# Altium schematic sheet 06_nRF52840_Analog.SchDoc
size 420 x 297 mm; Author: Shpakov Dmitry; Address1: Address1; Address2: Address2; Address3: Address3; Address4: Address4; DocumentNumber: АБВГ.123456.001 Э3; SheetNumber: 7; SheetTotal: 13; Scale: 1:1; DocumentType: Схема электрическая принципиальная; FirstReferrence: АБВГ.123456.001
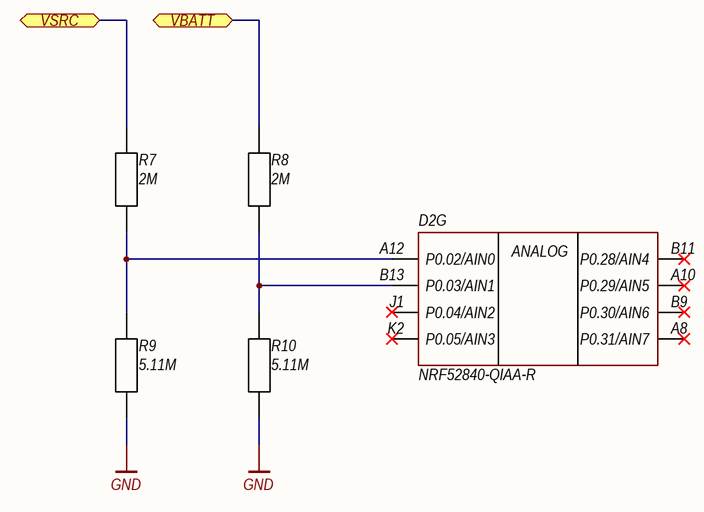
[diagram p0: 06_nRF52840_Analog.SchDoc]

## Parts
D2  NRF52840-QIAA-R  [AQFN50P700X700X85_HS-74N]  (part G of 9)
R7  2M  [RESC1608X05N]
R8  2M  [RESC1608X05N]
R9  5.11M  [RESC1608X05N]
R10  5.11M  [RESC1608X05N]

## Ports
VBATT, VSRC

## Nets
GND: R9.1 R10.1
VBATT: R8.2 ; port VBATT
VSRC: R7.2 ; port VSRC
NetD2_A12: D2.A12(P0.02/AIN0) R7.1 R9.2
NetD2_B13: D2.B13(P0.03/AIN1) R8.1 R10.2

Not connected (* = marked no-connect by the designer): D2 A8(P0.31/AIN7)* A10(P0.29/AIN5)* B9(P0.30/AIN6)* B11(P0.28/AIN4)* J1(P0.04/AIN2)* K2(P0.05/AIN3)*

## Notes on the sheet
- Author
- Manufacturer
- Date
- Page
- Total pages
- Size page
- A3
- Materials
- (in symbol nRF52840-QFN373, part G) ANALOG

## Library data of the parts
D2 = nRF52840-QFN373: IC RF TxRx + MCU 802.15.4, Bluetooth Bluetooth v5.0 2.4GHz 73-VFQFN Dual Rows, Exposed Pad; Manufacturer: Nordic Semiconductor ASA; Power/Voltage: 1.7V ~ 5.5V; Operation Temperature: -40...+85; Help URL: https://www.digikey.com/en/products/detail/nexperia-usa-inc/2N7002-215/762973; Type: IC RF TXRX+MCU 802.15.4; Value: *; Tolerance: *; Note: *; Case: 73-aQFN (7x7); PartNumber: NRF52840-QIAA-R
R7 R8 = resistor_smd: SMD resistor; Manufacturer: Yageo; PartNumber: RC0603JR-072ML; Power/Voltage: 1/10W; Tolerance: 5%; Operation Temperature: -55...+155; Help URL: https://www.digikey.com/en/products/detail/yageo/RC0603JR-072ML/726727; Type: resistor; Value: 2M; Note: *; Case: 0603
R9 R10 = resistor_smd: SMD resistor; Manufacturer: Yageo; PartNumber: RC0603FR-075M11L; Power/Voltage: 1/10; Tolerance: 1%; Operation Temperature: -55...+155; Help URL: https://www.digikey.com/en/products/detail/yageo/RC0603FR-075M11L/5918377; Type: resistor; Value: 5.11M; Note: *; Case: 0603